# Altium schematic sheet Expression_Pedal.SchDoc
size A3; SheetNumber: 9; SheetTotal: 13
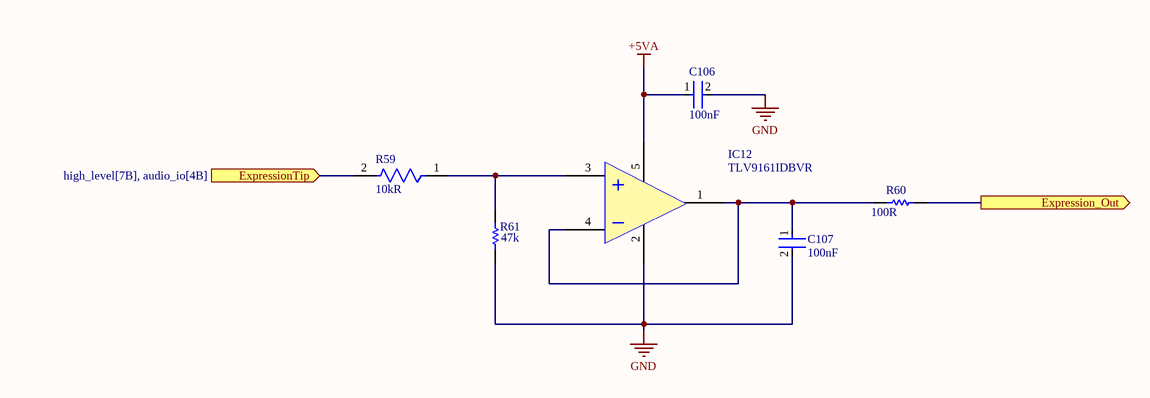
[diagram p0: Expression_Pedal.SchDoc]

## Parts
C106  Capacitance: 100nF  [FP-GRM033-0_03-IPC_C]  (hidden comment: GRM033C71C104ME14J)
C107  Capacitance: 100nF  [FP-GRM033-0_03-IPC_C]  (hidden comment: GRM033C71C104ME14J)
IC12  TLV9161IDBVR  [SOT95P280X145-5N]
R59  Resistance: 10kR  [FP-RC0402-0_4-IPC_A]  (hidden comment: RC0402FR-1310KL)
R60  Resistance: 100R  [RESC1005X40X25NL05T10]  (hidden comment: RC0402JR-07100RL)
R61  Resistance: 47k  [RESC1005X40X25LL05T10]  (hidden comment: RC0402JR-0747KL)

## Ports
Expression_Out (out, see high_level[7A], MCU_Connections[7B]), ExpressionTip (in, see high_level[7B], audio_io[4B])

## Nets
+5VA: C106.1 IC12.5(V+)
GND: C106.2 C107.2 IC12.2(V-) R61.1
Expression_Out: R60.2 ; port Expression_Out
ExpressionTip: R59.2 ; port ExpressionTip
NetC107_1: C107.1 IC12.1(OUT) IC12.4(IN-) R60.1
NetIC12_3: IC12.3(IN+) R59.1 R61.2

## Library data of the parts
C106 C107 = CMP-06035-001619-1: Chip Multilayer Ceramic Capacitors for General Purpose, 0201, 0.10uF, X7S, 22%, 20%, 16V; Dielectric: X7S; Tolerance: 20%; Length: 600um; Width: 300um; Voltage Rating (DC): 16V; Thickness: 300um
IC12 = TLV9161IDBVR: Integrated Circuit; Manufacturer_Name: Texas Instruments; Datasheet Link: https://www.ti.com/lit/ds/symlink/tlv9161.pdf?HQS=dis-mous-null-mousermode-dsf-pf-null-wwe&ts=1675947383550&ref_url=https%253A%252F%252Fwww.mouser.de%252F; Height: 1.45mm; Manufacturer_Part_Number: TLV9161IDBVR; Mouser Part Number: 595-TLV9161IDBVR; Mouser Price/Stock: https://www.mouser.co.uk/ProductDetail/Texas-Instruments/TLV9161IDBVR?qs=Rp5uXu7WBW%2FkWJAGvxG3xQ%3D%3D; Arrow Part Number: TLV9161IDBVR; Arrow Price/Stock: https://www.arrow.com/en/products/tlv9161idbvr/texas-instruments?utm_currency=USD&region=nac
R59 = CMP-2002-07854-2: RESISTOR 0402 10K 1%; Power Rating: 62.5mW; Voltage Rating (DC): 50V; Temperature Coefficient: 100ppm/°C; REACH SVHC: No SVHC; Case/Package: 0402; Termination: SMD/SMT; Max Operating Temperature: 155°C; Contact Plating: Tin; Resistance Tolerance: 1%; Radiation Hardening: No; Voltage Rating: 50V; Lead Free: Lead Free; Length: 1mm; Depth: 0.5mm; Number of Pins: 2; RoHS Compliant: Yes; Case Code (Imperial): 0402; Case Code (Metric): 1005; Min Operating Temperature: -55°C; Packaging: Tape and Reel; Technology: THICK FILM; Series: RC; Number of Terminations: 2; Resistor Type: Thick Film; Tolerance: 1%; Working Voltage: 50V; Military Standard: Not; Construction: Rectangular
R60 = CMP-2002-07914-1: Manufacturer: Yageo / Phycomp; Part Number: RC0402JR-07100RL
R61 = CMP-1011-00114-2: Manufacturer: Yageo / Phycomp; Part Number: RC0402JR-0747KL